# Altium schematic sheet LEDs.SchDoc
size A; SheetNumber: 4; SheetTotal: 4
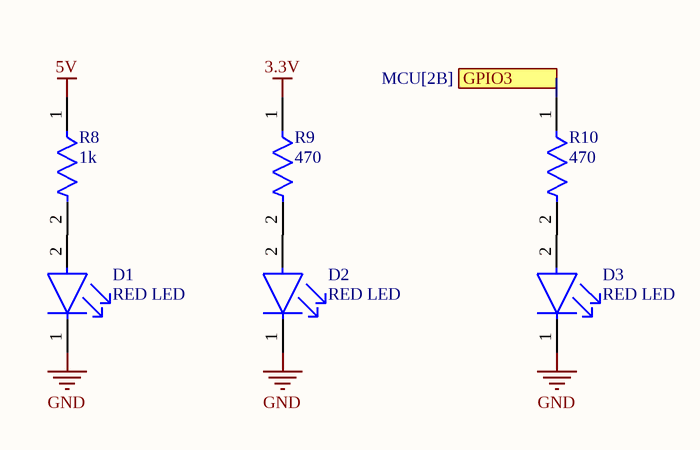
[diagram p0: LEDs.SchDoc]

## Parts
D1  RED LED  [FP-APTD1608SEC-J3-MFG]
D2  RED LED  [FP-APTD1608SEC-J3-MFG]
D3  RED LED  [FP-APTD1608SEC-J3-MFG]
R8  1k  [FP-RNCP0603-IPC_C]
R9  470  [FP-AC0603-IPC_A]
R10  470  [FP-AC0603-IPC_A]

## Ports
GPIO3 (see MCU[2B])

## Nets
3.3V: R9.1
5V: R8.1
GND: D1.1(C) D2.1(C) D3.1(C)
GPIO3: R10.1 ; port GPIO3
NetD1_2: D1.2(A) R8.2
NetD2_2: D2.2(A) R9.2
NetD3_2: D3.2(A) R10.2

## Library data of the parts
D1-D3 = CMP-44529-000051-1: LED RED CLEAR CHIP SMD; Number of LEDs: 1; Luminous Intensity: 900mcd; Test Current: 20mA; Lens Color: Colorless; Dominant Wavelength: 625nm; Viewing Angle: 60°; Forward Voltage: 2.2V; Case Code (Metric): 1608; Max Operating Temperature: 85°C; Color: Red; Lead Free: Lead Free; Height: 0.95mm; Forward Current: 20mA; Package Quantity: 2000; Lens Style: Clear; Min Operating Temperature: -40°C; Case/Package: 0603; Illumination Color: Red; Packaging: Tape and Reel; Case Code (Imperial): 0603; Length: 1.6mm; Width: 0.8mm; Mount: Surface Mount; Lens Transparency: Clear; Number of Pins: 4
R8 = CMP-26527-006179-1: 1kΩ ±1% 0.125W 0603 High Power Anti-Sulfur Thin Film Chip Resistor; Temperature Coefficient: 100ppm/°C; Max Power Dissipation: 125mW; Resistance: 1kR; Case/Package: 0603; Width: 0.031inch; Tolerance: 1%; Case Code (Imperial): 0603; RoHS Compliant: Yes; Min Operating Temperature: -55°C; Resistor Type: Thin Film; Features: Moisture Resistant; Length: 0.059inch; Mount: Surface Mount; Case Code (Metric): 1608; Height: 0.02inch; Max Operating Temperature: 155°C; Packaging: Tape and Reel; Series: RNCP; Number of Terminations: 2
R9 R10 = CMP-03412-002877-2: RES 470Ω 1.00% 0.1W 0603; Tolerance: 1%; Resistance: 470R; Case/Package: 0603; RoHS Compliant: Yes